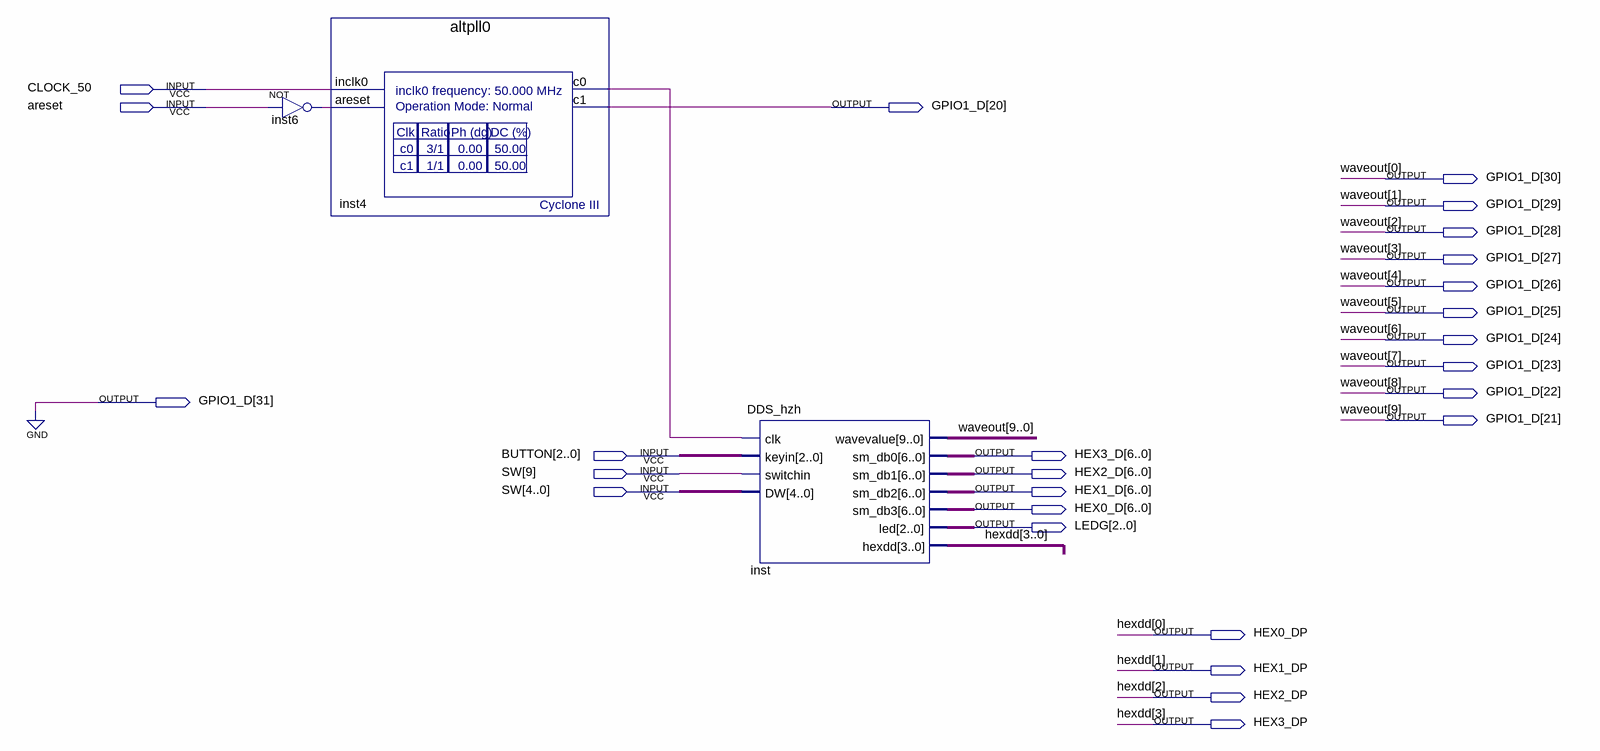
[diagram p0: schematic sheet]
// Quartus schematic My_DDS.bdf as structural Verilog: 3 symbols, 26 pins
module My_DDS (
  input  CLOCK_50,
  input  areset,
  input  [2:0] BUTTON,
  input  [9:0] SW,
  output [31:20] GPIO1_D,
  output [6:0] HEX3_D,
  output [6:0] HEX2_D,
  output [6:0] HEX1_D,
  output [6:0] HEX0_D,
  output [2:0] LEDG,
  output HEX0_DP,
  output HEX1_DP,
  output HEX2_DP,
  output HEX3_DP
);

  wire inst4_c0, inst6_out;

  not inst6 (inst6_out, areset);
  altpll0 inst4 (.inclk0(CLOCK_50), .areset(inst6_out), .c0(inst4_c0), .c1(GPIO1_D[20]));
  DDS_hzh inst (
    .clk(inst4_c0), .keyin(BUTTON), .switchin(SW[9]), .DW(SW[4:0]),
    .wavevalue({GPIO1_D[21], GPIO1_D[22], GPIO1_D[23], GPIO1_D[24], GPIO1_D[25], GPIO1_D[26], GPIO1_D[27], GPIO1_D[28], GPIO1_D[29], GPIO1_D[30]}),
    .sm_db0(HEX3_D), .sm_db1(HEX2_D), .sm_db2(HEX1_D), .sm_db3(HEX0_D), .led(LEDG),
    .hexdd({HEX3_DP, HEX2_DP, HEX1_DP, HEX0_DP}));

  assign GPIO1_D[31] = 1'b0;

  // Other names for the same wires on the sheet: hexdd[3:0] = {HEX3_DP, HEX2_DP, HEX1_DP, HEX0_DP};
  //   waveout[9:0] = {GPIO1_D[21], GPIO1_D[22], GPIO1_D[23], GPIO1_D[24], GPIO1_D[25], GPIO1_D[26], GPIO1_D[27], GPIO1_D[28], GPIO1_D[29], GPIO1_D[30]}
endmodule
